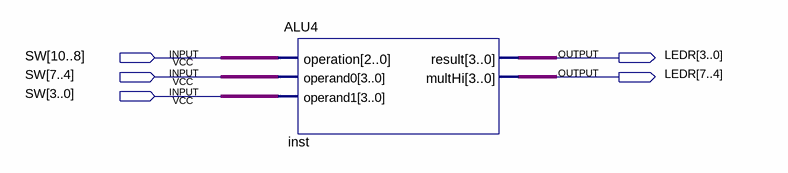
[diagram p0: schematic sheet]
// Quartus schematic ALU.bdf as structural Verilog: 1 symbols, 5 pins
module ALU (
  input  [10:0] SW,
  output [7:0] LEDR
);

  ALU4 inst (.operation(SW[10:8]), .operand0(SW[7:4]), .operand1(SW[3:0]), .result(LEDR[3:0]), .multHi(LEDR[7:4]));
endmodule
